# EAGLE schematic rechiever (EAGLE 7.2.0)
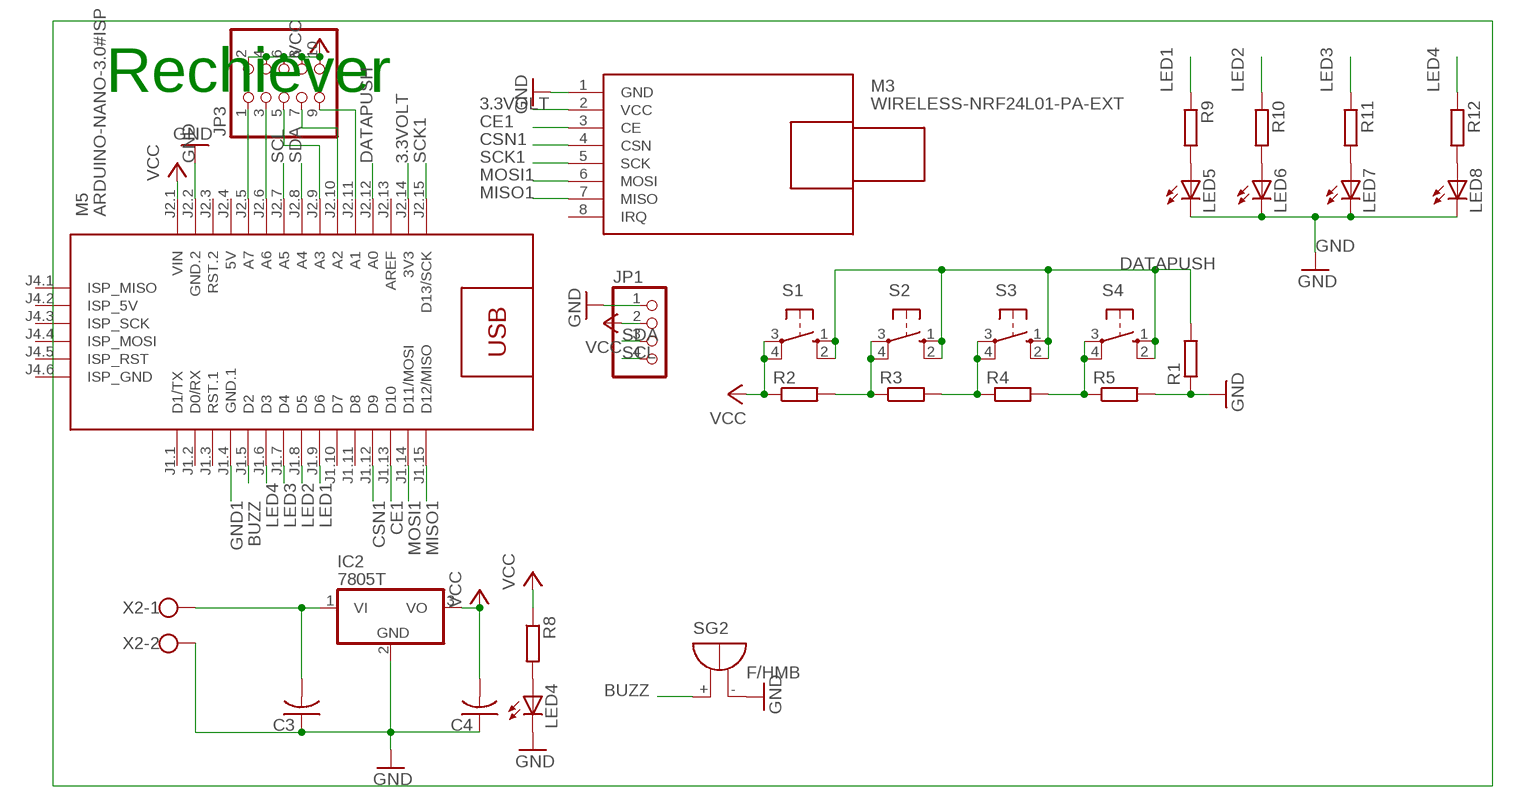
[diagram p0: schematic, sheet 1]

## Parts
C3  C-US025-050X050  [C025-050X050]
C4  C-US025-050X050  [C025-050X050]
IC2  7805T  [TO220H]
JP1  PINHD-1X4  [1X04]
JP3  PINHD-2X5  [2X05]
LED4  LED3MM  [LED3MM]
LED5  LED5MM  [LED5MM]
LED6  LED5MM  [LED5MM]
LED7  LED5MM  [LED5MM]
LED8  LED5MM  [LED5MM]
M3  WIRELESS-NRF24L01-PA-EXT  [WIRELESS-NRF24L01-PA-EXT]
M5  ARDUINO-NANO-3.0#ISP  [ARDUINO-NANO-3.0#ISP]
R1  R-EU_0207/7  [0207/7]
R2  R-EU_0207/7  [0207/7]
R3  R-EU_0207/7  [0207/7]
R4  R-EU_0207/7  [0207/7]
R5  R-EU_0207/7  [0207/7]
R8  R-EU_0207/7  [0207/7]
R9  R-EU_0207/7  [0207/7]
R10  R-EU_0207/7  [0207/7]
R11  R-EU_0207/7  [0207/7]
R12  R-EU_0207/7  [0207/7]
S1  10-XX  [B3F-10XX]
S2  10-XX  [B3F-10XX]
S3  10-XX  [B3F-10XX]
S4  10-XX  [B3F-10XX]
SG2  F/HMB  [F/HMB]
X2  W237-102  [W237-102]

## Nets
3.3VOLT: M3.2(VCC) M5.J2.14(3V3)
BUZZ: M5.J1.5(D2) SG2.+
CE1: M3.3(CE) M5.J1.13(D10)
CSN1: M3.4(CSN) M5.J1.12(D9)
DATAPUSH: M5.J2.12(A0) R1.2 S1.1(S) S1.2(S1) S2.1(S) S2.2(S1) S3.1(S) S3.2(S1) S4.1(S) S4.2(S1)
GND: C3.1 C4.1 IC2.2(GND) JP1.1 LED4.K(C) LED5.K(C) LED6.K(C) LED7.K(C) LED8.K(C) M3.1(GND) M5.J2.2(GND.2) R1.1 R5.2 SG2.- X2.2
GND1: M5.J1.4(GND.1)
LED1: M5.J1.9(D6) R9.1
LED2: M5.J1.8(D5) R10.1
LED3: M5.J1.7(D4) R11.1
LED4: M5.J1.6(D3) R12.1
MISO1: M3.7(MISO) M5.J1.15(D12/MISO)
MOSI1: M3.6(MOSI) M5.J1.14(D11/MOSI)
N$1: JP3.1 M5.J2.5(A7)
N$2: JP3.3 M5.J2.6(A6)
N$4: JP3.5 M5.J2.9(A3)
N$5: R2.2 R3.1 S2.3(P) S2.4(P1)
N$6: JP3.7 M5.J2.10(A2)
N$7: R3.2 R4.1 S3.3(P) S3.4(P1)
N$8: JP3.9 M5.J2.11(A1)
N$9: R4.2 R5.1 S4.3(P) S4.4(P1)
N$11: C3.2 IC2.1(VI) X2.1
N$12: LED4.A R8.2
N$24: LED5.A R9.2
N$25: LED6.A R10.2
N$26: LED7.A R11.2
N$27: LED8.A R12.2
SCK1: M3.5(SCK) M5.J2.15(D13/SCK)
SCL: JP1.4 M5.J2.7(A5)
SDA: JP1.3 M5.J2.8(A4)
VCC: C4.2 IC2.3(VO) JP1.2 JP3.2 JP3.4 JP3.6 JP3.8 JP3.10 M5.J2.1(VIN) R2.1 R8.1 S1.3(P) S1.4(P1)
Unconnected: M3.8(IRQ) M5.J1.1(D1/TX) M5.J1.2(D0/RX) M5.J1.3(RST.1) M5.J1.10(D7) M5.J1.11(D8) M5.J2.3(RST.2) M5.J2.13(AREF) M5.J4.1(ISP_MISO) M5.J4.2(ISP_5V) M5.J4.3(ISP_SCK) M5.J4.4(ISP_MOSI) M5.J4.5(ISP_RST) M5.J4.6(ISP_GND)

## Notes on the sheet
- Rechiever

## Power pins joined to a net without a drawn wire
5V: M5.J2.4(5V)

## Library data of the parts
C3 C4 = adafruit:C-US: CAPACITOR, American symbol
IC2 = adafruit:78*: Positive VOLTAGE REGULATOR Added bigger pads to the TO-92 package
JP1 = pinhead:PINHD-1X4: PIN HEADER
JP3 = pinhead:PINHD-2X5: PIN HEADER
LED4-LED8 = adafruit:LED: LED OSRAM: - CHIPLED LG R971, LG N971, LY N971, LG Q971, LY Q971, LO R971, LY R971 LH N974, LH R974 LS Q976, LO Q976, LY Q976 LO Q996 - Hyper CHIPLED LW Q18S LB Q993, LB Q99A, LB R99A - SideLED LS A670, LO A670, LY A670, LG A670, LP A670 LB A673, LV A673, LT A673, LW A673 LH A674 LY A675 LS A676, LA A676, LO A676, LY A676, LW A676 LS A679, LY A679, LG A679 - Hyper Micro SIDELED® LS Y876, LA Y876, LO Y876, LY Y876 LT Y87S - SmartLED LW L88C, LW L88S LB L89C, LB L89S, LG L890 LS L89K, LO L89K, LY L89K LS L896, LA L896, LO L896, LY L896 - TOPLED LS T670, LO T670, LY T670, LG T670, LP T670 LSG T670, LSP T670, LSY T670, LOP T670, LYG T670 LG T671, LOG T671, LSG T671 LB T673, LV T673, LT T673, LW T673 LH T674 LS T676, LA T676, LO T676, LY T676, LB T676, LH T676, LSB T676, LW T676 LB T67C, LV T67C, LT T67C, LS T67K, LO T67K, LY T67K, LW E67C LS E67B, LA E67B, LO E67B, LY E67B, LB E67C, LV E67C, LT E67C LW T67C LS T679, LY T679, LG T679 LS T770, LO T770, LY T770, LG T770, LP T770 LB T773, LV T773, LT T773, LW T773 LH T774 LS E675, LA E675, LY E675, LS T675 LS T776, LA T776, LO T776, LY T776, LB T776 LHGB T686 LT T68C, LB T68C - Hyper Mini TOPLED® LB M676 - Mini TOPLED Santana® LG M470 LS M47K, LO M47K, LY M47K Source: http://www.osram.convergy.de/
M3 = diy-modules:WIRELESS-NRF24L01-PA-EXT: 2.4 GHz Wireless Module based on NRF24L01 chip with preamplifier and external antenna Click here to find device on ebay.com <http://www.ebay.com/sch/nrf24l01+pa+lna+sma>
M5 = diy-modules:ARDUINO-NANO-3.0#ISP: Arduino Nano 3.0 (and compatible devices) with ISP pads More details available here: https://www.arduino.cc/en/Main/ArduinoBoardNano Click here to find device on ebay.com <http://www.ebay.com/sch/arduino+nano>
R1-R5 R8-R12 = rcl:R-EU_: RESISTOR, European symbol
S1-S4 = switch-omron:10-XX: OMRON SWITCH; MPN: B3F-1000; OC_FARNELL: 176432; OC_NEWARK: 36M3542
SG2 = buzzer:F/HMB: BUZZER Source: Buerklin; OC_FARNELL: unknown; OC_NEWARK: unknown
X2 = con-wago-500:W237-102: WAGO SCREW CLAMP; MPN: 237-102; OC_FARNELL: unknown; OC_NEWARK: 70K9898